# Altium schematic sheet Schem_pdr.SchDoc
size A4; SheetNumber: 2; SheetTotal: 2
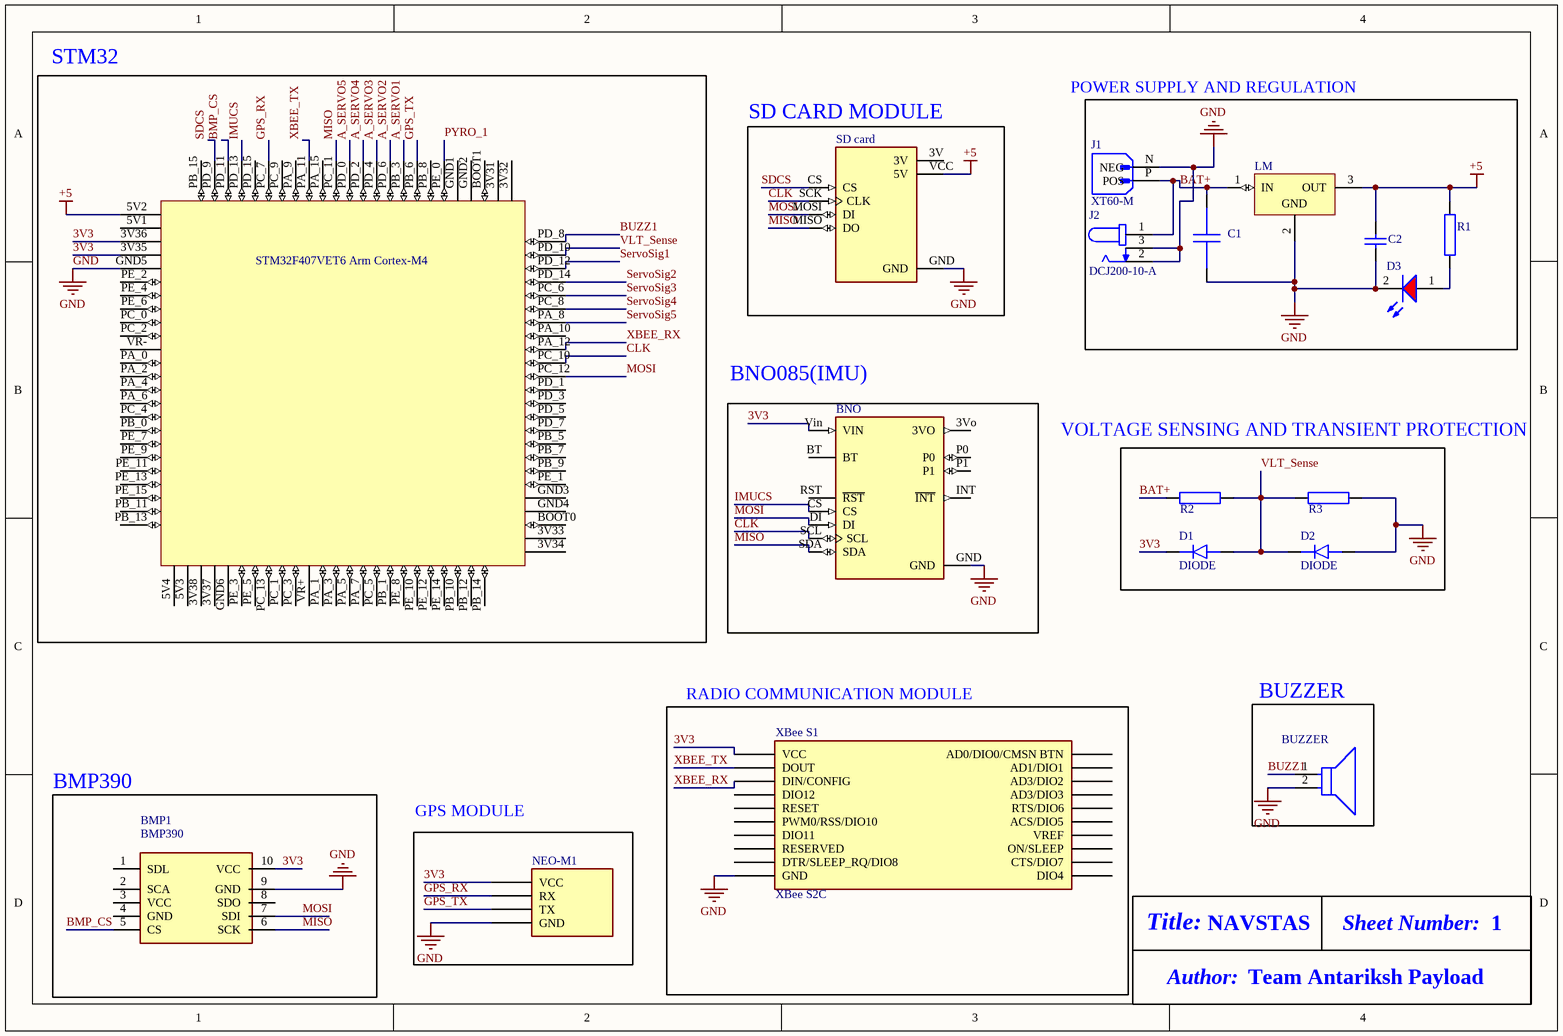
[diagram p0: Schem_pdr.SchDoc]

## Parts
BMP1  Component_1  [BMP390]  (value not drawn)
BNO  4754  [BNO085]  (value not drawn)
BUZZER  (no value)  [FP-PKB24SPCH3601-B0-MFG]
C1  0.22u  [CAP_0.22u]  (value not drawn)
C2  K104K15X7RF5TL2  [VISH-K104K15X7RF5TL2]  (value not drawn)
D1  DIODE  [DIOAD1036W78L470D235]
D2  DIODE  [DIOAD1036W78L470D235]
D3  151051RS11000  [WL-TMRC_D5.9H8.7]  (value not drawn)
J1  XT60-M  [AMASS_XT60-M]
J2  DCJ200-10-A  [GCT_DCJ200-10-A-XX-K_REVA]
LM  (no value)  [FAIR-TO-220-3]
NEO-M1  NEO-M8N  [NEO 6M]  (value not drawn)
R1  1k  [Res1k]  (value not drawn)
R2  33k  [Res1k]  (value not drawn)
R3  10k  [Res1k]  (value not drawn)
SD_card  SD CARD MODULE  [SDC]
STM  STM32F407VET6  [STM32_F407VET6]  (value not drawn)
XBee_S1  XBee S2C  [XBEE S2C]

## Blocks framed on the sheet
STM32: STM
BNO085(IMU): BNO
RADIO COMMUNICATION MODULE: XBee_S1
BUZZER: BUZZER
BMP390: BMP1
GPS MODULE: NEO-M1

## Nets
+5: C2.2 LM.3(OUT) R1.1 SD_card.VCC(5V) STM.5V2
GND: BMP1.9(GND) BNO.GND BUZZER.2(A) C1.2 C2.1 D2.1 D3.2(K) J1.N(NEG) J2.2 J2.3 LM.2(GND) NEO-M1.GND R3.1 SD_card.GND STM.GND5 XBee_S1.10(GND)
3V3: BMP1.10(VCC) BNO.Vin(VIN) D1.2 NEO-M1.VCC STM.3V35 STM.3V36 XBee_S1.1(VCC)
A_SERVO1: STM.PB_3
A_SERVO2: STM.PD_6
A_SERVO3: STM.PD_4
A_SERVO4: STM.PD_2
A_SERVO5: STM.PD_0
BAT+: C1.1 J1.P(POS) J2.1 LM.1(IN) R2.1
BMP_CS: BMP1.5(CS) STM.PD_11
BUZZ1: BUZZER.1(C) STM.PD_8
CLK: BNO.SCL SD_card.SCK(CLK) STM.PC_10
GPS_RX: NEO-M1.RX STM.PC_7
GPS_TX: NEO-M1.TX STM.PB_6
IMUCS: BNO.CS STM.PD_13
MISO: BMP1.6(SCK) BNO.SDA SD_card.MISO(DO) STM.PC_11
MOSI: BMP1.7(SDI) BNO.DI SD_card.MOSI(DI) STM.PC_12
PYRO_1: STM.PE_0
SDCS: SD_card.CS STM.PD_9
ServoSig1: STM.PD_12
ServoSig2: STM.PD_14
ServoSig3: STM.PC_6
ServoSig4: STM.PC_8
ServoSig5: STM.PA_8
VLT_Sense: D1.1 D2.2 R2.2 R3.2 STM.PD_10
XBEE_RX: STM.PA_12 XBee_S1.3(DIN/CONFIG)
XBEE_TX: STM.PA_11 XBee_S1.2(DOUT)
NetD3_1: D3.1(A) R1.2

Not connected (* = marked no-connect by the designer): BMP1 1(SDL) 2(SCA) 3(VCC) 4(GND) 8(SDO); BNO 3Vo(3VO) BT INT(~{INT}) P0 P1 RST(~{RST}); SD_card 3V; STM 3V31 3V32 3V33 3V34 3V37 3V38 5V1 5V3 5V4 BOOT0 BOOT1 GND1 GND2 GND3 GND4 GND6 PA_0 PA_1 PA_2 PA_3 PA_4 PA_5 PA_6 PA_7 PA_9 PA_10 PA_15 PB_0 PB_1 PB_5 PB_7 PB_8 PB_9 PB_10 PB_11 PB_12 PB_13 PB_14 PB_15 PC_0 PC_1 PC_2 PC_3 PC_4 PC_5 PC_9 PC_13 PD_1 PD_3 PD_5 PD_7 PD_15 PE_1 PE_2 PE_3 PE_4 PE_5 PE_6 PE_7 PE_8 PE_9 PE_10 PE_11 PE_12 PE_13 PE_14 PE_15 VR+ VR-; XBee_S1 4(DIO12) 5(RESET) 6(PWM0/RSS/DIO10) 7(DIO11) 8(RESERVED) 9(DTR/SLEEP_RQ/DIO8) 11(DIO4) 12(CTS/DIO7) 13(ON/SLEEP) 14(VREF) 15(ACS/DIO5) 16(RTS/DIO6) 17(AD3/DIO3) 18(AD3/DIO2) 19(AD1/DIO1) 20(AD0/DIO0/CMSN_BTN)

## Notes on the sheet
- POWER SUPPLY AND REGULATION
- VOLTAGE SENSING AND TRANSIENT PROTECTION
- Title:
- Author:
- NAVSTAS
- Team Antariksh Payload
- Sheet Number:
- 1
- (in symbol Component_1) BMP390
- (in symbol STM32F407VET6) STM32F407VET6 Arm Cortex-M4

## Library data of the parts
BNO = 4754: Adafruit 9-DOF Orientation IMU Fusion Breakout - BNO085 (BNO080) - STEMMA QT / Qwiic; MP: 4754; SnapEDA_Link: https://www.snapeda.com/parts/4754/Adafruit+Industries/view-part/?ref=snap; Price: None; Purchase-URL: https://pricing.snapeda.com/search/part/4754/?ref=eda; MF: Adafruit; Package: None; Availability: In Stock; Check_prices: https://www.snapeda.com/parts/4754/Adafruit+Industries/view-part/?ref=eda; Value: *
BUZZER = CMP-06203-000001-2: AUDIO PIEZO TRANSDUCER 3-15V TH; Self Resonant Frequency: 3.6kHz; Voltage Rating (DC): 15V; Min Supply Voltage: 3V; Operating Supply Current: 16mA; Voltage Rating: 12V; Max Frequency: 4.1kHz; Washable: No; REACH SVHC: No SVHC; Packaging: Bulk; Frequency: 3.6kHz; Max Operating Temperature: 70°C; Max Supply Voltage: 15V; Max Supply Voltage (DC): 15V; Diameter: 24.3mm; Lead Free: Lead Free; Radiation Hardening: No; Nominal Supply Current: 16mA; Height: 9.7mm; Mount: Flush; Nominal Supply Voltage (DC): 12V; Min Operating Temperature: -20°C; Termination: PC Pins; Length: 24.3mm; Package Quantity: 650; Min Supply Voltage (DC): 3V; Max Supply Current: 16mA
C1 = CAP: Capacitors
C2 = CMP-2000-06508-1: Ceramic Capacitor, 100 nF, +/- 10%, 50 V, -55 to 125 degC, 2-Pin THD, RoHS, Tape and Reel; Manufacturer: Vishay; Other Names: BC1084CT; Catalog Drawings: Mono-KapSide2-15_5.58Mono-KapSide1_15; Temperature Coefficient: X7R; Voltage - Rated: 50V; Online Catalog: Mono-Kap™Series; Capacitance: 0.1µF; Size / Dimension: 0.157"Lx0.098"W(4.00mmx2.50mm); Operating Temperature: -55°C~125°C; Family: CeramicCapacitors; Manufacturer URL: http://www.vishay.com/; Standard Package: 1; Thickness (Max): -; Ratings: -; Datasheet Version: 08/2013; Package Description: 2-Pin Through Hole Device, Body 4 x 2.6 mm; Mounting Type: ThroughHole; Features: -; Lead Spacing: 0.098"(2.50mm); Tolerance: ±10%; Category: Capacitors; Mounting Technology: ThroughHole; Lead Style: Straight; Datasheet URL: http://www.vishay.com/docs/45171/kseries.pdf; Applications: GeneralPurpose; Package / Case: Radial; Height - Seated (Max): 0.220"(5.58mm); Package Reference: K104K15X7RF5TL2; Series: Mono-Kap™K; Packaging: CutTape(CT)
D1 D2 = DIODE: Clamp diode for surge protection in voltage measurement circuit
D3 = CMP-1488-00008-2: NexarPartId: 29717813; Lens Style: Circular, Diffused, Round; Lens Size: 5mm; Forward Voltage: 2.1V; Peak Wavelength: 650nm; Forward Current: 100mA; Viewing Angle: 60°; Color: Red; Wavelength: 630nm; Test Current: 20mA; Dominant Wavelength: 645nm; Luminous Intensity: 30mcd; Max Reverse Voltage (DC): 5V; Height: 8.6mm; Length: 5mm; Min Operating Temperature: -40°C; Max Operating Temperature: 85°C; Packaging: Bulk; REACH SVHC: Unknown; Case/Package: Radial; RoHS: Compliant; Width: 5mm; Mount: Through Hole
J1 = XT60-M: Plug; DC supply; XT60; male; PIN: 2; for cable; soldered; 30A; 500V; MF: AMASS; SnapEDA_Link: https://www.snapeda.com/parts/XT60-M/AMASS/view-part/?ref=snap; Package: Package; Value: *; MP: XT60-M; Check_prices: https://www.snapeda.com/parts/XT60-M/AMASS/view-part/?ref=eda
J2 = DCJ200-10-A-XX-K_REVA: Power Barrel Connector Jack 2.05mm ID (0.081), 5.50mm OD (0.217) Through Hole, Right Angle; MF: Global Connector Technology; MP: DCJ200-10-A-K1-K; SnapEDA_Link: https://www.snapeda.com/parts/DCJ200-10-A-K1-K/Global+Connector+Technology/view-part/?ref=snap; Package: None; Value: *; Check_prices: https://www.snapeda.com/parts/DCJ200-10-A-K1-K/Global+Connector+Technology/view-part/?ref=eda
LM = CMP-2000-04938-1: Positive Voltage Regulator, 5 V, 1 A, -40 to 125 degC, 3-Pin TO-220, RoHS, Tube; Manufacturer: FairchildSemiconductor; Maximum Input Voltage: 35V; Maximum Quiescent Current: 8mA; Load Regulation: 100mV; Maximum Output Current: 2.2(Typ)A; Output Type: Fixed; Typical Dropout Voltage @ Current: 2@1AV; Rad Hard: No; Output Voltage: 5V; Accuracy: ±4%; Number of Outputs: 1; Category: LinearRegulator; Package Description: 3-Pin Through Hole Device, Body 10 x 4.5 mm, Pitch 2.54 mm; Packaging: Rail/Tube; Mounting: ThroughHole; Polarity: Positive; Manufacturer URL: https://www.fairchildsemi.com/; Line Regulation: 100mV; Datasheet Version: Aug-12; Datasheet URL: https://datasheet.ciiva.com/26904/lm7805ct-26904988.pdf; Package Reference: TO-220; Package URL: https://www.fairchildsemi.com/package-drawings/TO/TO220B03.pdf; Package: 3TO-220AB; Operating Temperature: -40to125degC; Type: Linear
NEO-M1 = NEO-M8N: u-blox M8 concurrent GNSS module
R1-R3 = Res: SMD Resistor
SD_card = 254: MicroSD card breakout board+; MF: Keystone Electronics; Check_prices: https://www.snapeda.com/parts/254/Adafruit+Industries/view-part/?ref=eda; Value: *; Purchase-URL: https://pricing.snapeda.com/search/part/254/?ref=eda; Package: Keystone Electronics; Price: None; MP: 254; Availability: In Stock; SnapEDA_Link: https://www.snapeda.com/parts/254/Adafruit+Industries/view-part/?ref=snap
XBee_S1 = XBee S2C: XBee S2C 802.15.4 module